# EAGLE schematic FPGA_DENDY (EAGLE 9.4.2)
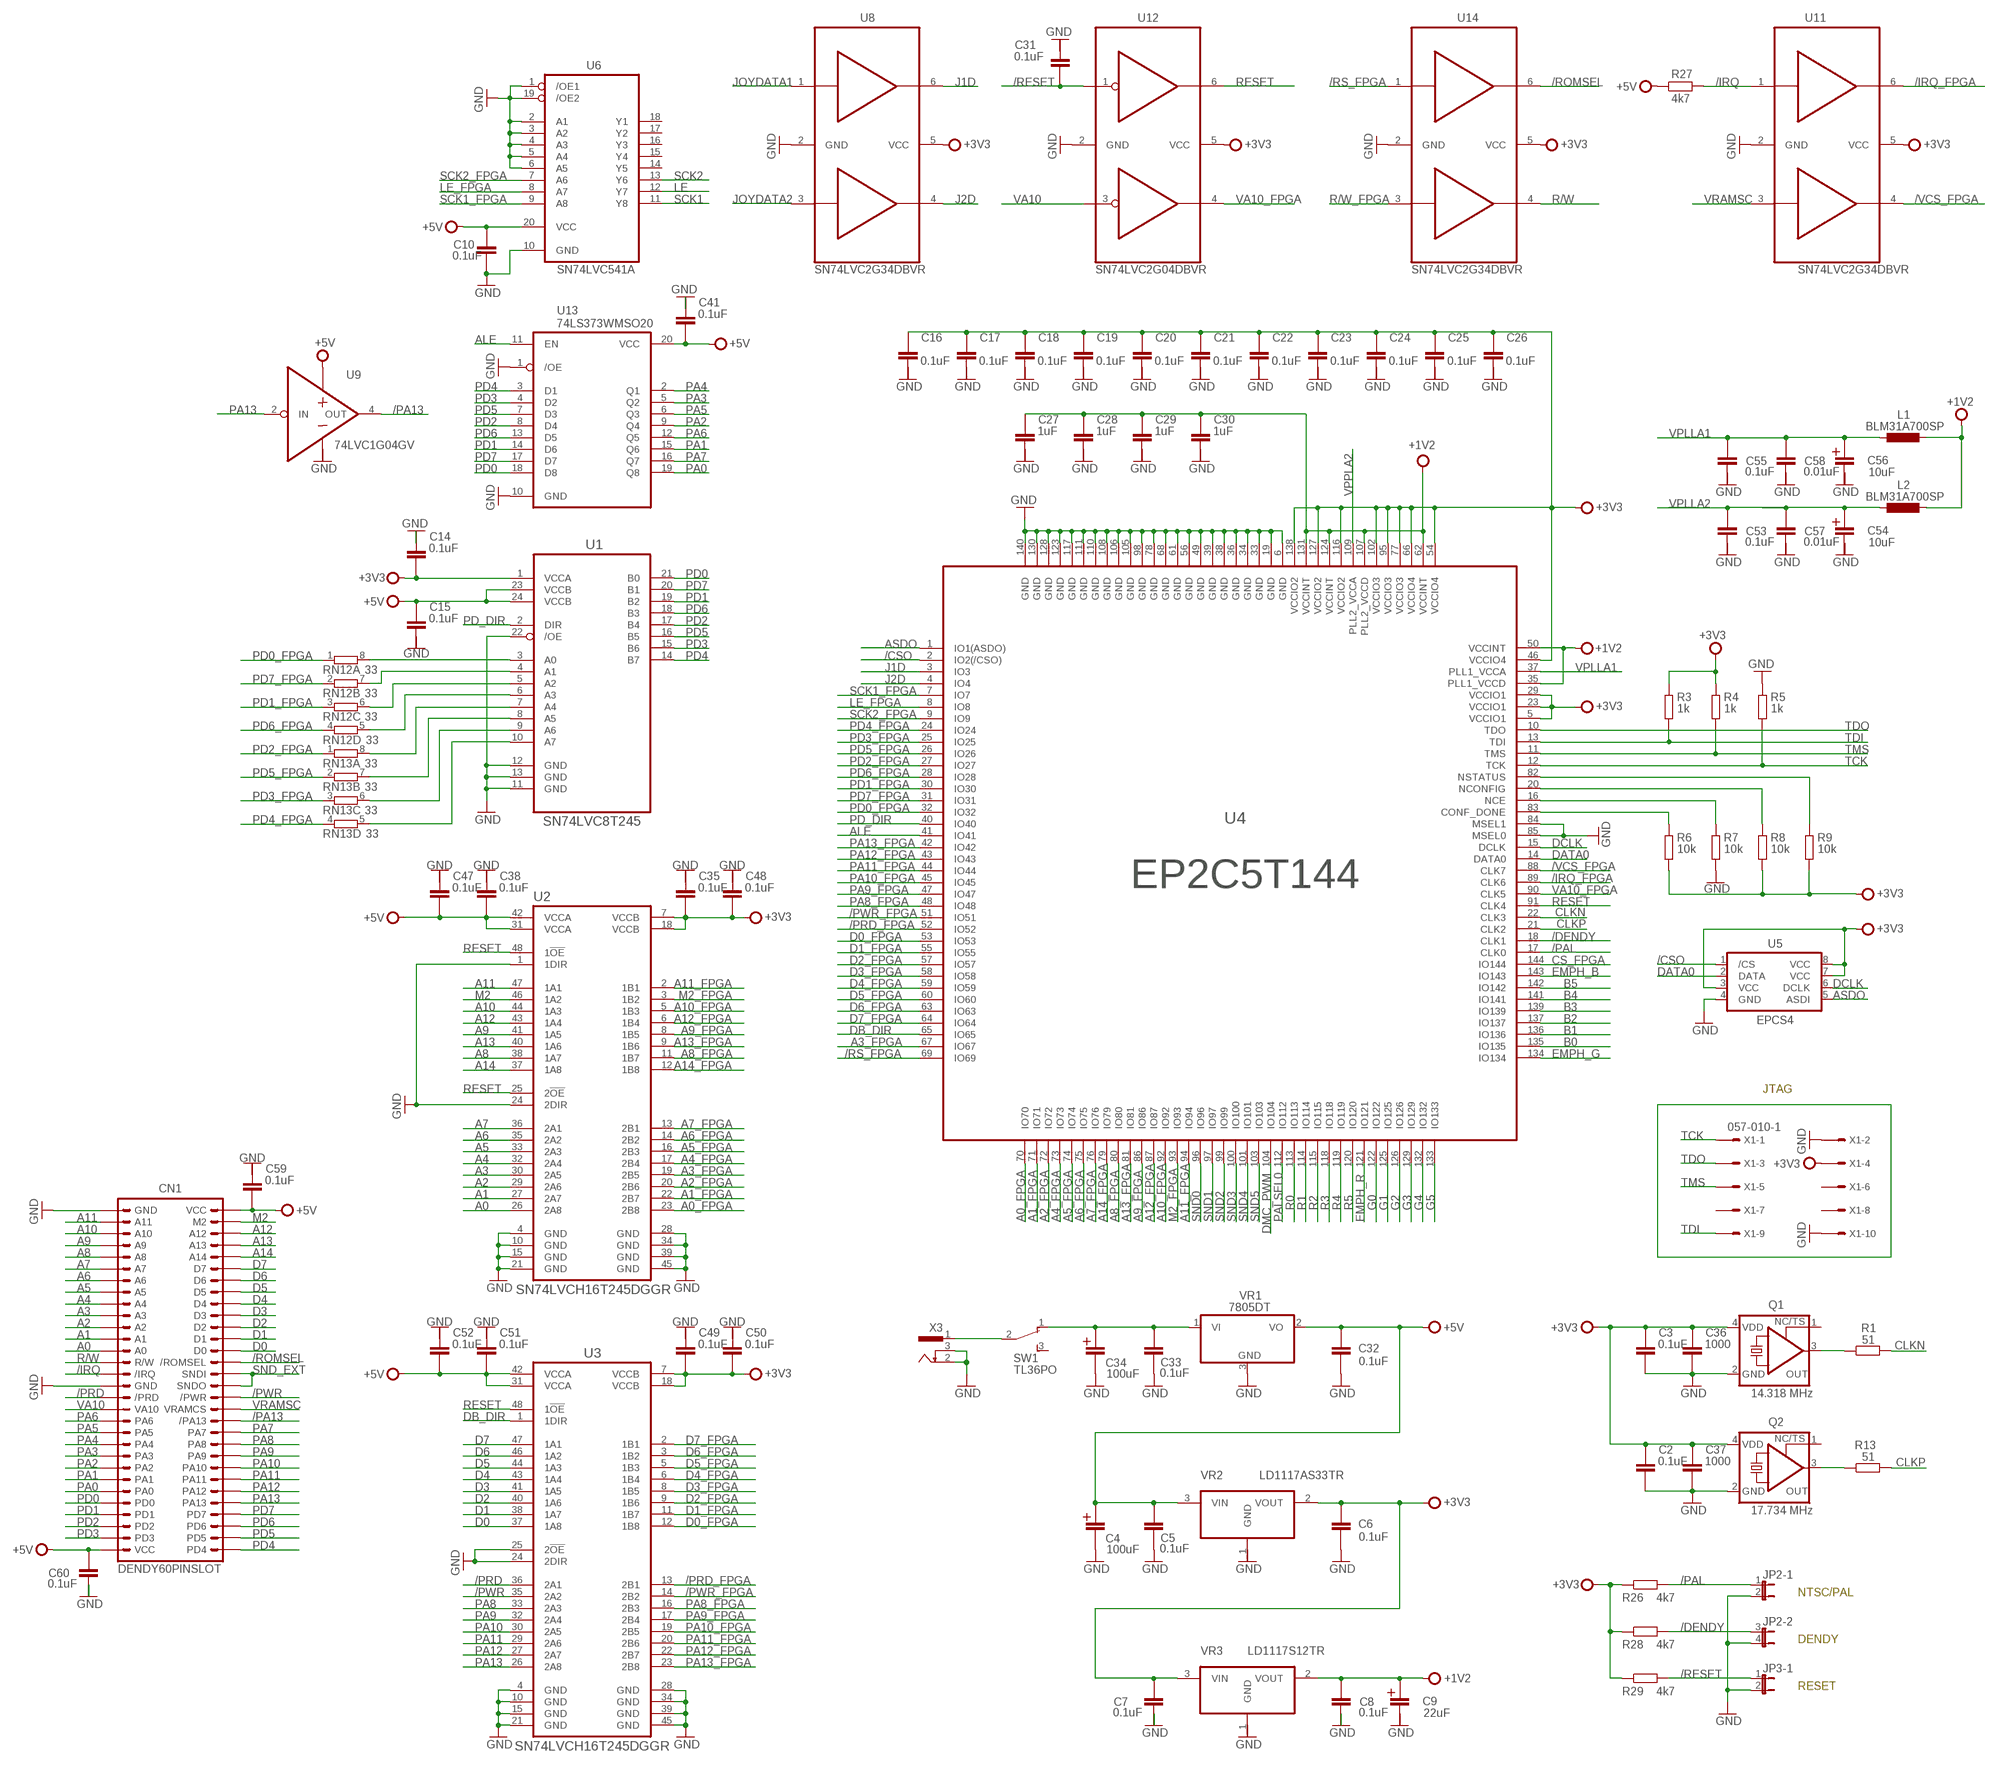
[diagram p0: schematic, sheet 1, part 1 of 2]
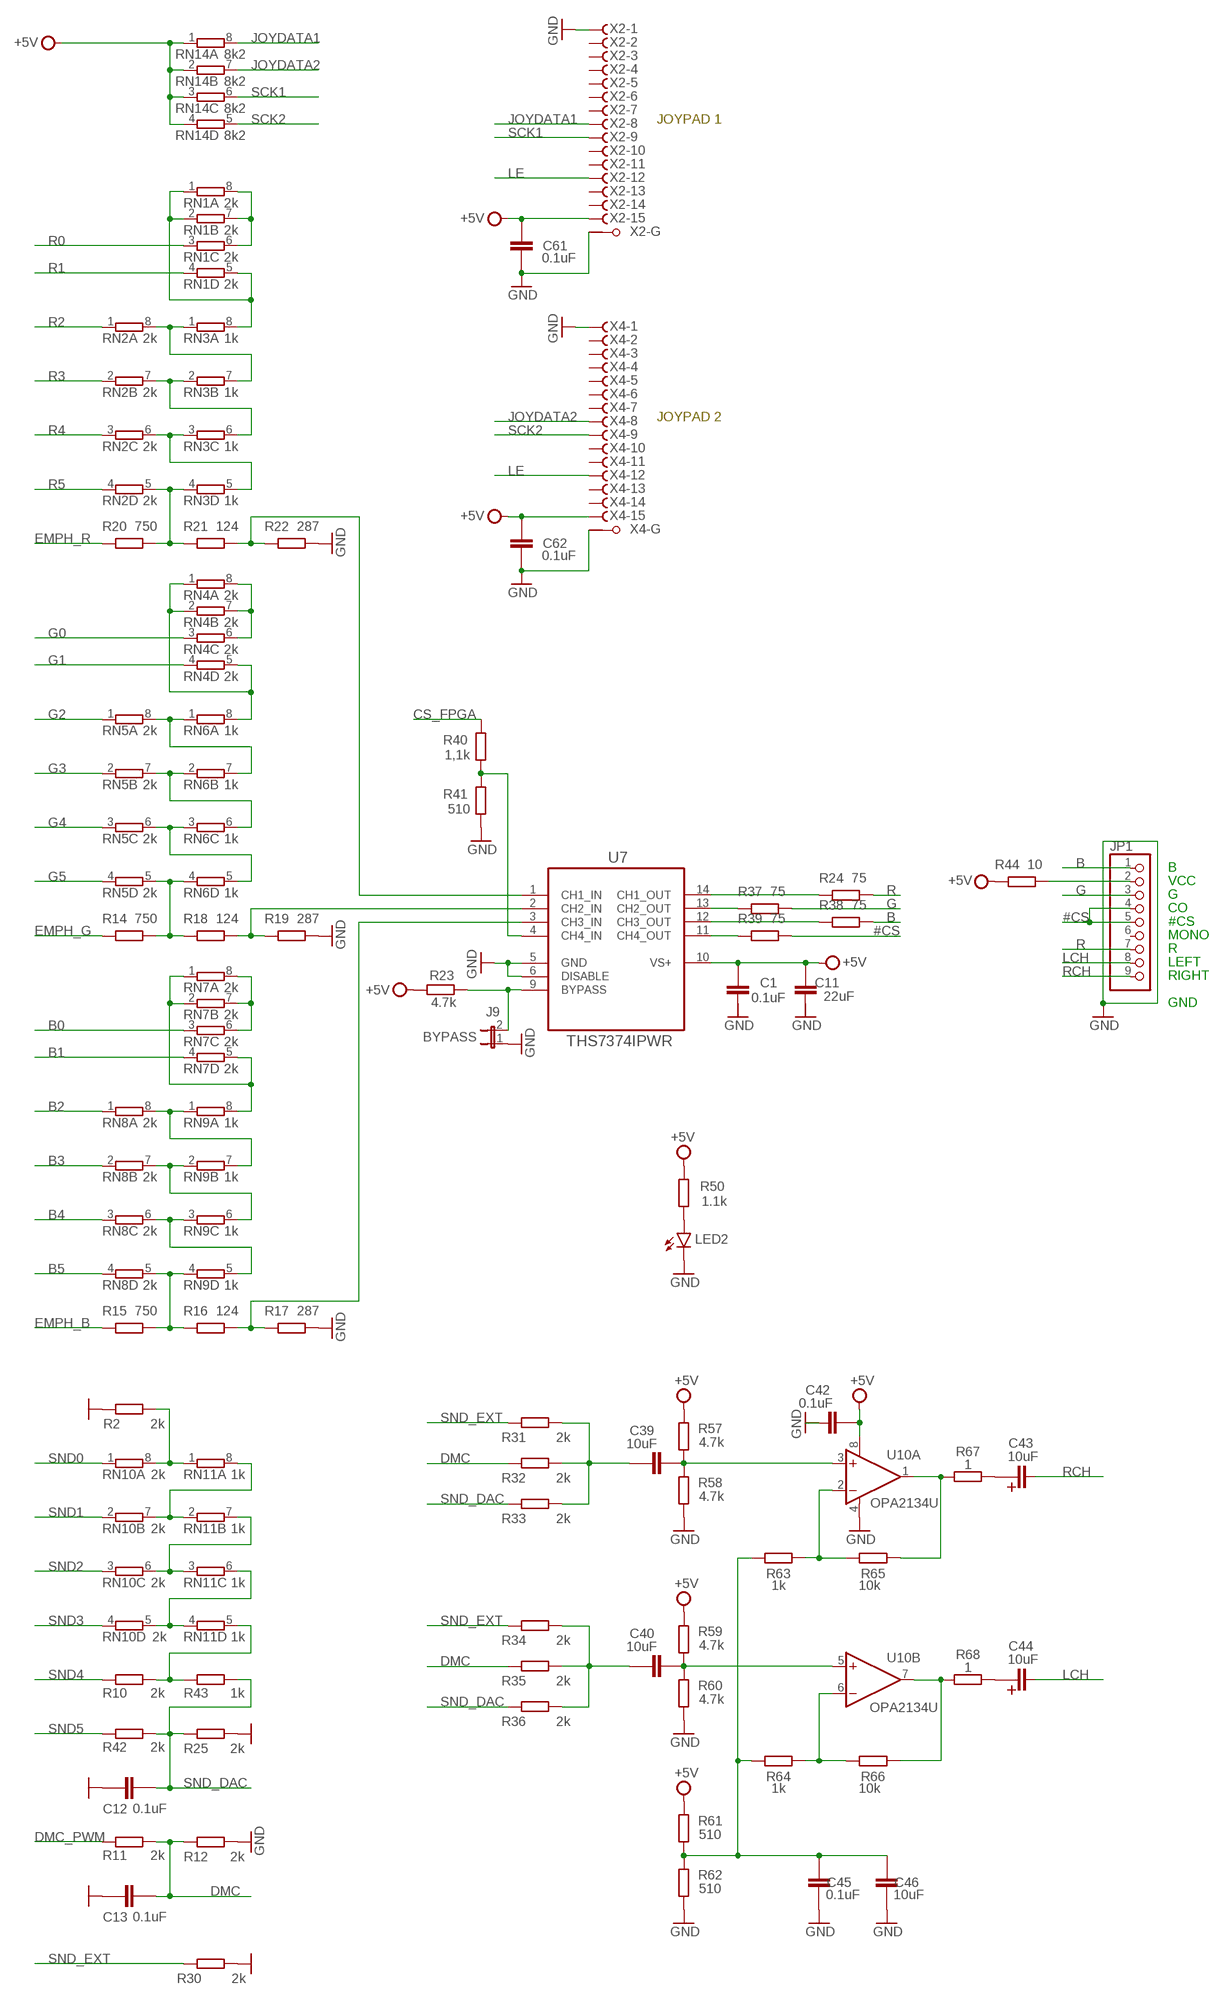
[diagram p1: schematic, sheet 1, part 2 of 2]

## Parts
C1  0.1uF  C-EUC0603  [C0603]
C2  0.1uF  C-EUC0805  [C0805]
C3  0.1uF  C-EUC0805  [C0805]
C4  100uF  CPOL-EU153CLV-0505  [153CLV-0505]
C5  0.1uF  C-EUC0805  [C0805]
C6  0.1uF  C-EUC0805  [C0805]
C7  0.1uF  C-EUC0805  [C0805]
C8  0.1uF  C-EUC0805  [C0805]
C9  22uF  CPOL-EU153CLV-0505  [153CLV-0505]
C10  0.1uF  C-EUC0805  [C0805]
C11  22uF  C-EUC0603  [C0603]
C12  0.1uF  C-EUC0805  [C0805]
C13  0.1uF  C-EUC0805  [C0805]
C14  0.1uF  C-EUC0805  [C0805]
C15  0.1uF  C-EUC0805  [C0805]
C16  0.1uF  C-EUC0805  [C0805]
C17  0.1uF  C-EUC0805  [C0805]
C18  0.1uF  C-EUC0805  [C0805]
C19  0.1uF  C-EUC0805  [C0805]
C20  0.1uF  C-EUC0805  [C0805]
C21  0.1uF  C-EUC0805  [C0805]
C22  0.1uF  C-EUC0805  [C0805]
C23  0.1uF  C-EUC0805  [C0805]
C24  0.1uF  C-EUC0805  [C0805]
C25  0.1uF  C-EUC0805  [C0805]
C26  0.1uF  C-EUC0805  [C0805]
C27  1uF  C-EUC0805  [C0805]
C28  1uF  C-EUC0805  [C0805]
C29  1uF  C-EUC0805  [C0805]
C30  1uF  C-EUC0805  [C0805]
C31  0.1uF  C-EUC0805  [C0805]
C32  0.1uF  C-EUC0805  [C0805]
C33  0.1uF  C-EUC0805  [C0805]
C34  100uF  CPOL-EU153CLV-0505  [153CLV-0505]
C35  0.1uF  C-EUC0805  [C0805]
C36  1000  C-EUC0805  [C0805]
C37  1000  C-EUC0805  [C0805]
C38  0.1uF  C-EUC0805  [C0805]
C39  10uF  C-EUC0805  [C0805]
C40  10uF  C-EUC0805  [C0805]
C41  0.1uF  C-EUC0805  [C0805]
C42  0.1uF  C-EUC0805  [C0805]
C43  10uF  CPOL-EU153CLV-0505  [153CLV-0505]
C44  10uF  CPOL-EU153CLV-0505  [153CLV-0505]
C45  0.1uF  C-EUC0805  [C0805]
C46  10uF  C-EUC0805  [C0805]
C47  0.1uF  C-EUC0805  [C0805]
C48  0.1uF  C-EUC0805  [C0805]
C49  0.1uF  C-EUC0805  [C0805]
C50  0.1uF  C-EUC0805  [C0805]
C51  0.1uF  C-EUC0805  [C0805]
C52  0.1uF  C-EUC0805  [C0805]
C53  0.1uF  C-EUC0805  [C0805]
C54  10uF  CPOL-EU153CLV-0505  [153CLV-0505]
C55  0.1uF  C-EUC0805  [C0805]
C56  10uF  CPOL-EU153CLV-0505  [153CLV-0505]
C57  0.01uF  C-EUC0805  [C0805]
C58  0.01uF  C-EUC0805  [C0805]
C59  0.1uF  C-EUC0805  [C0805]
C60  0.1uF  C-EUC0805  [C0805]
C61  0.1uF  C-EUC0805  [C0805]
C62  0.1uF  C-EUC0805  [C0805]
CN1  DENDY60PINSLOT  [60PINDENDY]
J9  BYPASS  JP1E  [JP1]
JP1  PINHD-1X9  [1X09]
JP2  JP4QE  [JP4Q]
JP3  JP4QE  [JP4Q]
L1  BLM31A700SP  L-EUL2012C  [L2012C]
L2  BLM31A700SP  L-EUL2012C  [L2012C]
LED2  LEDSML1206  [SML1206]
Q1  14.318 MHz  KXO-PXO/XO-V97  [7.0X5.08_KXO-(V)97]
Q2  17.734 MHz  KXO-PXO/XO-V95  [2.5X2.0_KXO-V95]
R1  51  R-EU_R0805  [R0805]
R2  2k  R-EU_R0805  [R0805]
R3  1k  R-EU_R0805  [R0805]
R4  1k  R-EU_R0805  [R0805]
R5  1k  R-EU_R0805  [R0805]
R6  10k  R-EU_R0805  [R0805]
R7  10k  R-EU_R0805  [R0805]
R8  10k  R-EU_R0805  [R0805]
R9  10k  R-EU_R0805  [R0805]
R10  2k  R-EU_R0805  [R0805]
R11  2k  R-EU_R0805  [R0805]
R12  2k  R-EU_R0805  [R0805]
R13  51  R-EU_R0805  [R0805]
R14  750  R-EU_R0805  [R0805]
R15  750  R-EU_R0805  [R0805]
R16  124  R-EU_R0805  [R0805]
R17  287  R-EU_R0805  [R0805]
R18  124  R-EU_R0805  [R0805]
R19  287  R-EU_R0805  [R0805]
R20  750  R-EU_R0805  [R0805]
R21  124  R-EU_R0805  [R0805]
R22  287  R-EU_R0805  [R0805]
R23  4.7k  R-EU_R0805  [R0805]
R24  75  R-EU_R0805  [R0805]
R25  2k  R-EU_R0805  [R0805]
R26  4k7  R-EU_R0805  [R0805]
R27  4k7  R-EU_R0805  [R0805]
R28  4k7  R-EU_R0805  [R0805]
R29  4k7  R-EU_R0805  [R0805]
R30  2k  R-EU_R0805  [R0805]
R31  2k  R-EU_R0805  [R0805]
R32  2k  R-EU_R0805  [R0805]
R33  2k  R-EU_R0805  [R0805]
R34  2k  R-EU_R0805  [R0805]
R35  2k  R-EU_R0805  [R0805]
R36  2k  R-EU_R0805  [R0805]
R37  75  R-EU_R0805  [R0805]
R38  75  R-EU_R0805  [R0805]
R39  75  R-EU_R0805  [R0805]
R40  1,1k  R-EU_R0805  [R0805]
R41  510  R-EU_R0805  [R0805]
R42  2k  R-EU_R0805  [R0805]
R43  1k  R-EU_R0805  [R0805]
R44  10  R-EU_R0805  [R0805]
R50  1.1k  R-EU_R0805  [R0805]
R57  4.7k  R-EU_R0805  [R0805]
R58  4.7k  R-EU_R0805  [R0805]
R59  4.7k  R-EU_R0805  [R0805]
R60  4.7k  R-EU_R0805  [R0805]
R61  510  R-EU_R0805  [R0805]
R62  510  R-EU_R0805  [R0805]
R63  1k  R-EU_R0805  [R0805]
R64  1k  R-EU_R0805  [R0805]
R65  10k  R-EU_R0805  [R0805]
R66  10k  R-EU_R0805  [R0805]
R67  1  R-EU_R0805  [R0805]
R68  1  R-EU_R0805  [R0805]
RN1  2k  4R-N0603-ARC  [0603-ARC]
RN2  2k  4R-N0603-ARC  [0603-ARC]
RN3  1k  4R-N0603-ARC  [0603-ARC]
RN4  2k  4R-N0603-ARC  [0603-ARC]
RN5  2k  4R-N0603-ARC  [0603-ARC]
RN6  1k  4R-N0603-ARC  [0603-ARC]
RN7  2k  4R-N0603-ARC  [0603-ARC]
RN8  2k  4R-N0603-ARC  [0603-ARC]
RN9  1k  4R-N0603-ARC  [0603-ARC]
RN10  2k  4R-N0603-ARC  [0603-ARC]
RN11  1k  4R-N0603-ARC  [0603-ARC]
RN12  33  4R-N0603-ARC  [0603-ARC]
RN13  33  4R-N0603-ARC  [0603-ARC]
RN14  8k2  4R-N0603-ARC  [0603-ARC]
SW1  TL36PO  [TL3XPO]
U1  SN74LVC8T245  [SOP65P640X110-24N]
U2  SN74LVCH16T245DGGR  [SOP50P810X120-48N]
U3  SN74LVCH16T245DGGR  [SOP50P810X120-48N]
U4  EP2C5T144  [TQFP144]
U5  EPCS4  [SO08]
U6  SN74LVC541A  [TSOP20]
U7  THS7374IPWR  [SOP65P640X120-14N]
U8  SN74LVC2G34DBVR  [SOT-23-6]
U9  74LVC1G04GV  [SOT95P275X110-5N]
U10  OPA2134U  [SO08]
U11  SN74LVC2G34DBVR  [SOT-23-6]
U12  SN74LVC2G04DBVR  [SOT-23-6]
U13  74LS373WMSO20  [SO20W]
U14  SN74LVC2G34DBVR  [SOT-23-6]
VR1  7805DT  [TO252]
VR2  LD1117AS33TR  [SOT230P700X180-4N]
VR3  LD1117S12TR  [SOT-223-3]
X1  057-010-1  [057-010-1]
X2  F15HPS  [F15HP]
X3  733980-62  [733980-62]
X4  F15HPS  [F15HP]

## Nets
#CS: JP1.4 JP1.5 R39.2
+1V2: C8.1 C9.+ C27.1 C28.1 C29.1 C30.1 L1.1 L2.1 U4.35(PLL1_VCCD) U4.50(VCCINT) U4.62(VCCINT) U4.107(PLL2_VCCD) U4.124(VCCINT) U4.131(VCCINT) VR3.2(VOUT)
+3V3: C2.1 C3.1 C6.1 C7.1 C14.2 C35.2 C36.1 C37.1 C48.2 C49.2 C50.2 Q1.4(VDD) Q2.4(VDD) R3.1 R4.1 R6.2 R8.2 R9.2 R26.1 R28.1 R29.1 U1.1(VCCA) U2.7(VCCB) U2.18(VCCB) U3.7(VCCB) U3.18(VCCB) U4.5(VCCIO1) U4.23(VCCIO1) U4.29(VCCIO1) U5.3(VCC) U5.7(VCC) U5.8(VCC) U8.5(VCC) U11.5(VCC) U12.5(VCC) U14.5(VCC) VR2.2(VOUT) VR3.3(VIN) X1.4
+5V: C1.2 C4.+ C5.1 C10.1 C11.2 C15.1 C32.1 C38.2 C41.2 C42.2 C47.2 C51.2 C52.2 C59.2 C60.1 C61.1 C62.1 CN1.A30(VCC) CN1.B1(VCC) R23.1 R27.1 R44.1 R50.2 R57.1 R59.1 R61.1 RN14.1 RN14.2 RN14.3 RN14.4 U1.23(VCCB) U1.24(VCCB) U2.31(VCCA) U2.42(VCCA) U3.31(VCCA) U3.42(VCCA) U6.20(VCC) U7.10(VS+) U9.5(VCC) U10.8(A:V+) U13.20(VCC) VR1.2(VO) VR2.3(VIN) X2.15(-15:F) X4.15(-15:F)
/CSO: U4.2(IO2(/CSO)) U5.1(/CS)
/DENDY: JP2.3 R28.2 U4.18(CLK1)
/IRQ: CN1.A15(/IRQ) R27.2 U11.1(IN1)
/IRQ_FPGA: U4.89(CLK6) U11.6(OUT1)
/PA13: CN1.B19(/PA13) U9.4(OUT)
/PAL: JP2.1 R26.2 U4.17(CLK0)
/PRD: CN1.A17(/PRD) U3.36(2A1)
/PRD_FPGA: U3.13(2B1) U4.52(IO52)
/PWR: CN1.B17(/PWR) U3.35(2A2)
/PWR_FPGA: U3.14(2B2) U4.51(IO51)
/RESET: C31.2 JP3.1 R29.2 U12.1(IN1)
/ROMSEL: CN1.B14(/ROMSEL) U14.6(OUT1)
/RS_FPGA: U4.69(IO69) U14.1(IN1)
/VCS_FPGA: U4.88(CLK7) U11.4(OUT2)
A0: CN1.A13(A0) U2.26(2A8)
A0_FPGA: U2.23(2B8) U4.70(IO70)
A1: CN1.A12(A1) U2.27(2A7)
A1_FPGA: U2.22(2B7) U4.71(IO71)
A2: CN1.A11(A2) U2.29(2A6)
A2_FPGA: U2.20(2B6) U4.72(IO72)
A3: CN1.A10(A3) U2.30(2A5)
A3_FPGA: U2.19(2B5) U4.67(IO67)
A4: CN1.A9(A4) U2.32(2A4)
A4_FPGA: U2.17(2B4) U4.73(IO73)
A5: CN1.A8(A5) U2.33(2A3)
A5_FPGA: U2.16(2B3) U4.74(IO74)
A6: CN1.A7(A6) U2.35(2A2)
A6_FPGA: U2.14(2B2) U4.75(IO75)
A7: CN1.A6(A7) U2.36(2A1)
A7_FPGA: U2.13(2B1) U4.76(IO76)
A8: CN1.A5(A8) U2.38(1A7)
A8_FPGA: U2.11(1B7) U4.80(IO80)
A9: CN1.A4(A9) U2.41(1A5)
A9_FPGA: U2.8(1B5) U4.86(IO86)
A10: CN1.A3(A10) U2.44(1A3)
A10_FPGA: U2.5(1B3) U4.92(IO92)
A11: CN1.A2(A11) U2.47(1A1)
A11_FPGA: U2.2(1B1) U4.94(IO94)
A12: CN1.B3(A12) U2.43(1A4)
A12_FPGA: U2.6(1B4) U4.87(IO87)
A13: CN1.B4(A13) U2.40(1A6)
A13_FPGA: U2.9(1B6) U4.81(IO81)
A14: CN1.B5(A14) U2.37(1A8)
A14_FPGA: U2.12(1B8) U4.79(IO79)
ALE: U4.41(IO41) U13.11(EN)
ASDO: U4.1(IO1(ASDO)) U5.5(ASDI)
B: JP1.1 R38.2
B0: RN7.3 U4.135(IO135)
B1: RN7.4 U4.136(IO136)
B2: RN8.1 U4.137(IO137)
B3: RN8.2 U4.139(IO139)
B4: RN8.3 U4.141(IO141)
B5: RN8.4 U4.142(IO142)
CLKN: R1.2 U4.22(CLK3)
CLKP: R13.2 U4.21(CLK2)
CS_FPGA: R40.2 U4.144(IO144)
D0: CN1.B13(D0) U3.37(1A8)
D0_FPGA: U3.12(1B8) U4.53(IO53)
D1: CN1.B12(D1) U3.38(1A7)
D1_FPGA: U3.11(1B7) U4.55(IO55)
D2: CN1.B11(D2) U3.40(1A6)
D2_FPGA: U3.9(1B6) U4.57(IO57)
D3: CN1.B10(D3) U3.41(1A5)
D3_FPGA: U3.8(1B5) U4.58(IO58)
D4: CN1.B9(D4) U3.43(1A4)
D4_FPGA: U3.6(1B4) U4.59(IO59)
D5: CN1.B8(D5) U3.44(1A3)
D5_FPGA: U3.5(1B3) U4.60(IO60)
D6: CN1.B7(D6) U3.46(1A2)
D6_FPGA: U3.3(1B2) U4.63(IO63)
D7: CN1.B6(D7) U3.47(1A1)
D7_FPGA: U3.2(1B1) U4.64(IO64)
DATA0: U4.14(DATA0) U5.2(DATA)
DB_DIR: U3.1(1DIR) U4.65(IO65)
DCLK: U4.15(DCLK) U5.6(DCLK)
DMC: C13.2 R11.2 R12.1 R32.1 R35.1
DMC_PWM: R11.1 U4.104(IO104)
EMPH_B: R15.1 U4.143(IO143)
EMPH_G: R14.1 U4.134(IO134)
EMPH_R: R20.1 U4.121(IO121)
G: JP1.3 R37.2
G0: RN4.3 U4.122(IO122)
G1: RN4.4 U4.125(IO125)
G2: RN5.1 U4.126(IO126)
G3: RN5.2 U4.129(IO129)
G4: RN5.3 U4.132(IO132)
G5: RN5.4 U4.133(IO133)
GND: C2.2 C3.2 C4.- C5.2 C6.2 C7.2 C8.2 C10.2 C12.1 C13.1 C14.1 C32.2 C33.2 C34.- C36.2 C37.2 C41.1 C42.1 C45.2 C46.2 C60.2 C61.2 C62.2 CN1.A1(GND) CN1.A16(GND) J9.1 JP2.2 JP2.4 JP3.2 LED2.C Q1.2(GND) Q2.2(GND) R2.1 R5.1 R7.2 R12.2 R17.2 R19.2 R22.2 R25.2 R30.2 R41.1 R58.2 R60.2 R62.2 U1.11(GND) U1.12(GND) U1.13(GND) U1.22(/OE) U2.1(1DIR) U2.4(GND) U2.10(GND) U2.15(GND) U2.21(GND) U2.24(2DIR) U2.28(GND) U2.34(GND) U2.39(GND) U2.45(GND) U3.4(GND) U3.10(GND) U3.15(GND) U3.21(GND) U3.24(2DIR) U3.25(2!OE) U3.28(GND) U3.34(GND) U3.39(GND) U3.45(GND) U4.6(GND) U4.19(GND) U4.33(GND) U4.34(GND) U4.36(GND) U4.38(GND) U4.39(GND) U4.49(GND) U4.56(GND) U4.61(GND) U4.68(GND) U4.78(GND) U4.84(MSEL1) U4.85(MSEL0) U4.98(GND) U4.105(GND) U4.106(GND) U4.108(GND) U4.110(GND) U4.111(GND) U4.117(GND) U4.123(GND) U4.128(GND) U4.130(GND) U4.140(GND) U5.4(GND) U6.1(/OE1) U6.2(A1) U6.3(A2) U6.4(A3) U6.5(A4) U6.6(A5) U6.10(GND) U6.19(/OE2) U7.5(GND) U7.6(DISABLE) U8.2(GND) U10.4(A:V-) U11.2(GND) U12.2(GND) U13.1(/OE) U13.10(GND) U14.2(GND) VR1.3(GND) X1.2 X1.10 X2.1(-1:F) X2.G1(-G:G1) X3.2 X3.3 X4.1(-1:F) X4.G1(-G:G1)
J1D: U4.3(IO3) U8.6(OUT1)
J2D: U4.4(IO4) U8.4(OUT2)
JOYDATA1: RN14.8 U8.1(IN1) X2.8(-8:F)
JOYDATA2: RN14.7 U8.3(IN2) X4.8(-8:F)
LCH: JP1.8
LE: U6.12(Y7) X2.12(-12:F) X4.12(-12:F)
LE_FPGA: U4.8(IO8) U6.8(A7)
M2: CN1.B2(M2) U2.46(1A2)
M2_FPGA: U2.3(1B2) U4.93(IO93)
N$1: C39.1 R31.2 R32.2 R33.2
N$2: Q2.3(OUT) R13.1
N$4: C43.-
N$5: RN10.7 RN11.2 RN11.8
N$6: Q1.3(OUT) R1.1
N$7: R7.1 U4.16(NCE)
N$8: R2.2 RN10.8 RN11.1
N$9: RN12.8 U1.3(A0)
N$10: RN12.7 U1.4(A1)
N$11: C44.-
N$12: RN12.6 U1.5(A2)
N$13: RN12.5 U1.6(A3)
N$14: RN8.8 RN9.1 RN9.7
N$15: C33.1 C34.+ SW1.1(O) VR1.1(VI)
N$16: RN7.6 RN7.7 RN7.8
N$17: RN13.8 U1.7(A4)
N$18: RN7.1 RN7.2 RN7.5 RN9.8
N$19: R16.2 R17.1 U7.3(CH3_IN)
N$20: R9.1 U4.82(NSTATUS)
N$21: R8.1 U4.20(NCONFIG)
N$22: R6.1 U4.83(CONF_DONE)
N$23: RN8.7 RN9.2 RN9.6
N$24: RN5.8 RN6.1 RN6.7
N$25: RN4.6 RN4.7 RN4.8
N$26: RN5.6 RN6.3 RN6.5
N$27: RN8.6 RN9.3 RN9.5
N$28: R18.2 R19.1 U7.2(CH2_IN)
N$29: R15.2 R16.1 RN8.5 RN9.4
N$30: C40.1 R34.2 R35.2 R36.2
N$31: RN13.7 U1.8(A5)
N$32: RN13.6 U1.9(A6)
N$33: RN4.1 RN4.2 RN4.5 RN6.8
N$34: RN2.8 RN3.1 RN3.7
N$35: RN1.6 RN1.7 RN1.8
N$36: RN5.7 RN6.2 RN6.6
N$37: C43.+ R67.2
N$38: R14.2 R18.1 RN5.5 RN6.4
N$39: RN1.1 RN1.2 RN1.5 RN3.8
N$40: RN2.7 RN3.2 RN3.6
N$41: RN2.6 RN3.3 RN3.5
N$42: R63.2 R65.1 U10.2(A:-IN)
N$43: R65.2 R67.1 U10.1(A:OUT)
N$44: R66.2 R68.1 U10.7(B:OUT)
N$45: R64.2 R66.1 U10.6(B:-IN)
N$46: C39.2 R57.2 R58.1 U10.3(A:+IN)
N$47: C40.2 R59.2 R60.1 U10.5(B:+IN)
N$48: C44.+ R68.2
N$50: JP1.2 R44.2
N$53: R20.2 R21.1 RN2.5 RN3.4
N$55: R10.2 R43.1 RN11.5
N$56: J9.2 R23.2 U7.9(BYPASS)
N$57: RN10.6 RN11.3 RN11.7
N$58: R21.2 R22.1 U7.1(CH1_IN)
N$59: RN10.5 RN11.4 RN11.6
N$61: RN13.5 U1.10(A7)
N$62: R40.1 R41.2 U7.4(CH4_IN)
N$63: LED2.A R50.1
N$64: R24.1 U7.14(CH1_OUT)
N$65: R37.1 U7.13(CH2_OUT)
N$66: R38.1 U7.12(CH3_OUT)
N$67: R39.1 U7.11(CH4_OUT)
N$77: SW1.2(P) X3.1
PA0: CN1.A25(PA0) U13.19(Q8)
PA1: CN1.A24(PA1) U13.15(Q6)
PA2: CN1.A23(PA2) U13.9(Q4)
PA3: CN1.A22(PA3) U13.5(Q2)
PA4: CN1.A21(PA4) U13.2(Q1)
PA5: CN1.A20(PA5) U13.6(Q3)
PA6: CN1.A19(PA6) U13.12(Q5)
PA7: CN1.B20(PA7) U13.16(Q7)
PA8: CN1.B21(PA8) U3.33(2A3)
PA8_FPGA: U3.16(2B3) U4.48(IO48)
PA9: CN1.B22(PA9) U3.32(2A4)
PA9_FPGA: U3.17(2B4) U4.47(IO47)
PA10: CN1.B23(PA10) U3.30(2A5)
PA10_FPGA: U3.19(2B5) U4.45(IO45)
PA11: CN1.B24(PA11) U3.29(2A6)
PA11_FPGA: U3.20(2B6) U4.44(IO44)
PA12: CN1.B25(PA12) U3.27(2A7)
PA12_FPGA: U3.22(2B7) U4.43(IO43)
PA13: CN1.B26(PA13) U3.26(2A8) U9.2(IN)
PA13_FPGA: U3.23(2B8) U4.42(IO42)
PALSEL0: U4.112(IO112)
PD0: CN1.A26(PD0) U1.21(B0) U13.18(D8)
PD0_FPGA: RN12.1 U4.32(IO32)
PD1: CN1.A27(PD1) U1.19(B2) U13.14(D6)
PD1_FPGA: RN12.3 U4.30(IO30)
PD2: CN1.A28(PD2) U1.17(B4) U13.8(D4)
PD2_FPGA: RN13.1 U4.27(IO27)
PD3: CN1.A29(PD3) U1.15(B6) U13.4(D2)
PD3_FPGA: RN13.3 U4.25(IO25)
PD4: CN1.B30(PD4) U1.14(B7) U13.3(D1)
PD4_FPGA: RN13.4 U4.24(IO24)
PD5: CN1.B29(PD5) U1.16(B5) U13.7(D3)
PD5_FPGA: RN13.2 U4.26(IO26)
PD6: CN1.B28(PD6) U1.18(B3) U13.13(D5)
PD6_FPGA: RN12.4 U4.28(IO28)
PD7: CN1.B27(PD7) U1.20(B1) U13.17(D7)
PD7_FPGA: RN12.2 U4.31(IO31)
PD_DIR: U1.2(DIR) U4.40(IO40)
R: JP1.7 R24.2
R0: RN1.3 U4.113(IO113)
R1: RN1.4 U4.114(IO114)
R2: RN2.1 U4.115(IO115)
R3: RN2.2 U4.118(IO118)
R4: RN2.3 U4.119(IO119)
R5: RN2.4 U4.120(IO120)
R/W: CN1.A14(R/W) U14.4(OUT2)
R/W_FPGA: U14.3(IN2)
RCH: JP1.9
RESET: U2.25(2!OE) U2.48(1!OE) U3.48(1!OE) U4.91(CLK4) U12.6(OUT1)
SCK1: RN14.6 U6.11(Y8) X2.9(-9:F)
SCK1_FPGA: U4.7(IO7) U6.9(A8)
SCK2: RN14.5 U6.13(Y6) X4.9(-9:F)
SCK2_FPGA: U4.9(IO9) U6.7(A6)
SND0: RN10.1 U4.96(IO96)
SND1: RN10.2 U4.97(IO97)
SND2: RN10.3 U4.99(IO99)
SND3: RN10.4 U4.100(IO100)
SND4: R10.1 U4.101(IO101)
SND5: R42.1 U4.103(IO103)
SND_DAC: C12.2 R25.1 R33.1 R36.1 R42.2 R43.2
SND_EXT: CN1.B15(SNDI) CN1.B16(SNDO) R30.1 R31.1 R34.1
TCK: R5.2 U4.12(TCK) X1.1
TDI: R3.2 U4.13(TDI) X1.9
TDO: U4.10(TDO) X1.3
TMS: R4.2 U4.11(TMS) X1.5
VA10: CN1.A18(VA10) U12.3(IN2)
VA10_FPGA: U4.90(CLK5) U12.4(OUT2)
VCC3.1: C16.1 C17.1 C18.1 C19.1 C20.1 C21.1 C22.1 C23.1 C24.1 C25.1 C26.1 U4.46(VCCIO4) U4.54(VCCIO4) U4.66(VCCIO4) U4.77(VCCIO3) U4.95(VCCIO3) U4.102(VCCIO3) U4.116(VCCIO2) U4.127(VCCIO2) U4.138(VCCIO2) ; supply symbol labelled +3V3
VPLLA1: C55.1 C56.+ C58.1 L1.2 U4.37(PLL1_VCCA)
VPLLA2: C53.1 C54.+ C57.1 L2.2
VPPL3: C45.1 C46.1 R61.2 R62.1 R63.1 R64.1
VPPLA2: U4.109(PLL2_VCCA)
VRAMSC: CN1.B18(VRAMCS) U11.3(IN2)
Unconnected: C1.1 C9.- C11.1 C15.2 C16.2 C17.2 C18.2 C19.2 C20.2 C21.2 C22.2 C23.2 C24.2 C25.2 C26.2 C27.2 C28.2 C29.2 C30.2 C31.1 C35.1 C38.1 C47.1 C48.1 C49.1 C50.1 C51.1 C52.1 C53.2 C54.- C55.2 C56.- C57.2 C58.2 C59.1 JP1.6 JP2.5 JP2.6 JP2.7 JP2.8 JP3.3 JP3.4 JP3.5 JP3.6 JP3.7 JP3.8 Q1.1(TS) Q2.1(TS) SW1.3(S) U6.14(Y5) U6.15(Y4) U6.16(Y3) U6.17(Y2) U6.18(Y1) U9.3(GND) VR2.1(GND) VR3.1(GND) X1.6 X1.7 X1.8 X2.2(-2:F) X2.3(-3:F) X2.4(-4:F) X2.5(-5:F) X2.6(-6:F) X2.7(-7:F) X2.10(-10:F) X2.11(-11:F) X2.13(-13:F) X2.14(-14:F) X2.G2(-G:G2) X4.2(-2:F) X4.3(-3:F) X4.4(-4:F) X4.5(-5:F) X4.6(-6:F) X4.7(-7:F) X4.10(-10:F) X4.11(-11:F) X4.13(-13:F) X4.14(-14:F) X4.G2(-G:G2)

## Notes on the sheet
- JOYPAD 1
- JOYPAD 2
- B
- VCC
- G
- CO
- #CS
- MONO
- R
- LEFT
- RIGHT
- GND
- JTAG
- NTSC/PAL
- DENDY
- RESET

## Library data of the parts
C1-C3 C5-C8 C10-C33 C35-C42 C45-C53 C55 C57-C62 = rcl_my:C-EU: CAPACITOR, European symbol; SPICEPREFIX: C
C4 C9 C34 C43 C44 C54 C56 = rcl_my:CPOL-EU: POLARIZED CAPACITOR, European symbol; SPICEPREFIX: C
CN1 = DENDY60pin:DENDY60PINSLOT
J9 = jumper:JP1E: JUMPER
JP1 = pinhead:PINHD-1X9: PIN HEADER
JP2 JP3 = jumper:JP4QE: JUMPER
L1 L2 = rcl:L-EU: INDUCTOR, European symbol; SPICEPREFIX: L
LED2 = led:LED: LED OSRAM: - CHIPLED LG R971, LG N971, LY N971, LG Q971, LY Q971, LO R971, LY R971 LH N974, LH R974 LS Q976, LO Q976, LY Q976 LO Q996 - Hyper CHIPLED LW Q18S LB Q993, LB Q99A, LB R99A - SideLED LS A670, LO A670, LY A670, LG A670, LP A670 LB A673, LV A673, LT A673, LW A673 LH A674 LY A675 LS A676, LA A676, LO A676, LY A676, LW A676 LS A679, LY A679, LG A679 - Hyper Micro SIDELED® LS Y876, LA Y876, LO Y876, LY Y876 LT Y87S - SmartLED LW L88C, LW L88S LB L89C, LB L89S, LG L890 LS L89K, LO L89K, LY L89K LS L896, LA L896, LO L896, LY L896 - TOPLED LS T670, LO T670, LY T670, LG T670, LP T670 LSG T670, LSP T670, LSY T670, LOP T670, LYG T670 LG T671, LOG T671, LSG T671 LB T673, LV T673, LT T673, LW T673 LH T674 LS T676, LA T676, LO T676, LY T676, LB T676, LH T676, LSB T676, LW T676 LB T67C, LV T67C, LT T67C, LS T67K, LO T67K, LY T67K, LW E67C LS E67B, LA E67B, LO E67B, LY E67B, LB E67C, LV E67C, LT E67C LW T67C LS T679, LY T679, LG T679 LS T770, LO T770, LY T770, LG T770, LP T770 LB T773, LV T773, LT T773, LW T773 LH T774 LS E675, LA E675, LY E675, LS T675 LS T776, LA T776, LO T776, LY T776, LB T776 LHGB T686 LT T68C, LB T68C - Hyper Mini TOPLED® LB M676 - Mini TOPLED Santana® LG M470 LS M47K, LO M47K, LY M47K Source: http://www.osram.convergy.de LUXEON: - LUMILED® LXK2-PW12-R00, LXK2-PW12-S00, LXK2-PW14-U00, LXK2-PW14-V00 LXK2-PM12-R00, LXK2-PM12-S00, LXK2-PM14-U00 LXK2-PE12-Q00, LXK2-PE12-R00, LXK2-PE12-S00, LXK2-PE14-T00, LXK2-PE14-U00 LXK2-PB12-K00, LXK2-PB12-L00, LXK2-PB12-M00, LXK2-PB14-N00, LXK2-PB14-P00, LXK2-PB14-Q00 LXK2-PR12-L00, LXK2-PR12-M00, LXK2-PR14-Q00, LXK2-PR14-R00 LXK2-PD12-Q00, LXK2-PD12-R00, LXK2-PD12-S00 LXK2-PH12-R00, LXK2-PH12-S00 LXK2-PL12-P00, LXK2-PL12-Q00, LXK2-PL12-R00 Source: www.luxeon.com KINGBRIGHT: KA-3528ASYC Source: www.kingbright.com
Q1 Q2 = crystal-geyer_V1_0:KXO-PXO/XO-V: Clock Oscillator (PXO/XO) MHz : KXO-V - Serie Model Size l/w/h [mm] Frequency Range Frequency Stability Temp. Range [°C] Output AECQ 200 availabel Datasheet KXO-V94 KXO-V94 KXO-V95 KXO-V95 KXO-V96 KXO-V96 KXO-V99 KXO-V99 KXO-97 KXO-V97 KXO-97 - KXO-V97 2.0/1.6/0.80 2.0/1.6/0.80 2.5/2.0/0.82 2.5/2.0/0.82 3.2/2.5/1.2 3.2/2.5/1.2 5.0/3.2/1.2 5.0/3.2/1.2 7.0/5.08/1.3 7.0/5.08/1.3 7.0/5.08/1.3 32,768 kHz 1,0 ~ 80,0 MHz 32,768 kHz 1,0 ~ 70,0 MHz 32,768 kHz 1,0 ~ 156,0 MHz 32,768 kHz 1,0 ~ 200,0 MHz 32,768 kHz 32,768 kHz 1,0 ~ 160,0 MHz ±25 … ±100ppm ±25 … ±100ppm ±25 … ±100ppm ±25 … ±100ppm ±25 … ±100ppm ±25 … ±100ppm ±25 … ±100ppm ±25 … ±100ppm ±25 … ±100ppm ±25 … ±100ppm ±25 … ±100ppm (*) -40°C …+85°C (*) -40°C …+85°C (*) -40°C …+85°C (*) -40°C …+85°C (*) -40°C …+85°C (*) -40°C …+85°C (*) -40°C …+85°C (*) -40°C …+85°C (*) -40°C …+85°C (*) -40°C …+85°C (*) -40°C …+85°C HCMOS HCMOS HCMOS HCMOS HCMOS HCMOS HCMOS HCMOS HCMOS HCMOS HCMOS - - yes yes yes yes - - - - - KXO-V94-kHz.pdf <http://www.geyer-electronic.de/uploads/tx_userartikelfrequenz/GEYER-KXO-V94-kHz.pdf> KXO-V94.pdf <http://www.geyer-electronic.de/uploads/tx_userartikelfrequenz/GEYER-KXO-V94.pdf> KXO-V95-kHz.pdf <http://www.geyer-electronic.de/uploads/tx_userartikelfrequenz/GEYER-KXO-V95-kHz.pdf> KXO-V95.pdf <http://www.geyer-electronic.de/uploads/tx_userartikelfrequenz/GEYER-KXO-V95.pdf> KXO-V96-kHz.pdf <http://www.geyer-electronic.de/uploads/tx_userartikelfrequenz/GEYER-KXO-V96-kHz.pdf> KXO-V96.pdf <http://www.geyer-electronic.de/uploads/tx_userartikelfrequenz/GEYER-KXO-V96.pdf> KXO-V99-kHz.pdf <http://www.geyer-electronic.de/uploads/tx_userartikelfrequenz/GEYER-KXO-V99-kHz.pdf> KXO-V99.pdf <http://www.geyer-electronic.de/uploads/tx_userartikelfrequenz/GEYER-KXO-V99.pdf> KXO-97-kHz.pdf <http://www.geyer-electronic.de/uploads/tx_userartikelfrequenz/GEYER-KXO-97-kHz.pdf> KXO-V97-kHz.pdf <http://www.geyer-electronic.de/uploads/tx_userartikelfrequenz/GEYER-KXO-V97-kHz.pdf> KXO-V97.pdf <http://www.geyer-electronic.de/uploads/tx_userartikelfrequenz/GEYER-KXO-V97.pdf> <http://www.geyer-electronic.de/fileadmin/template/img/logo-geyer-electronic.png> Details see: http://www.geyer-electronic.de/Frequenz-Produkte.9.0.html Created 2016-06-07, Hans Locher 2016 (C) Geyer Quartz Technology Hans Locher KXOV94,KXOV95;KXOV96;KXOV97;KXO97;2016;2520;3225;5032;70508;2,5x2,0;3,2x2,5;5,0x3,2;7,0x5,08;2.5x2.0;3.2x2.5;5.0x3.2;7.0x5.08;
R1-R44 R50 R57-R68 = rcl:R-EU_: RESISTOR, European symbol; SPICEPREFIX: R
RN1-RN14 = resistor-dil:4R-N: Array Chip Resistor Source: RS Component / Phycomp; OC_FARNELL: unknown; OC_NEWARK: unknown
SW1 = switch:TL36PO: TINY SWITCH ON - ON Source: http://www2.produktinfo.conrad.com/datenblaetter/700000-724999/705152-da-01-de-Subminiaturschalter_TL_36YO.pdf
U1 = SnapEDA-Library:SN74LVC8T245
U2 U3 = SN74LVCH16T245DGGR:SN74LVCH16T245DGGR: Check availability <https://pricing.snapeda.com/parts/SN74LVCH16T245DGGR/Texas%20Instruments/view-part?ref=eda>; AVAILABILITY: In Stock; CHECK_PRICES: https://www.snapeda.com/parts/SN74LVCH16T245DGGR/Texas+Instruments/view-part/?ref=eda; DESCRIPTION: 16-Bit Dual-Supply Bus Transceiver, Configurable Voltage Translation, 3-State Outputs; MF: Texas Instruments; MP: SN74LVCH16T245DGGR; PACKAGE: TSSOP-48 Texas Instruments; PRICE: None; SNAPEDA_LINK: https://www.snapeda.com/parts/SN74LVCH16T245DGGR/Texas+Instruments/view-part/?ref=snap
U4 = altera-cyclone-II:EP2C5T144: EP2C5T144 Auto generated by make-symbol-device-package-bsdl.ulp Rev. 19 Tip: Use split-device-symbol.ulp to generate a Device with multiple small symbols! Read HELP. Source: EP2C5T144.BSD; MPN: EP2C5T144C8N; OC_FARNELL: 1453495; OC_NEWARK: 51R0568
U5 = EPCS4:EPCS4
U6 = SnapEDA-Library:SN74LVC541A; PACKAGE: TSSOP-20; SUPPLIER: TI
U7 = THS7374IPWR:THS7374IPWR
U8 U11 U14 = SN74LVC2G34DBVR:SN74LVC2G34DBVR
U9 = 74LVC1G04GV:74LVC1G04GV
U10 = burr-brown:OPA2134: Operational Amplifier; MF: TEXAS INSTRUMENTS; MPN: OPA2134UA; OC_FARNELL: 1206935; OC_NEWARK: 35C1847
U12 = SN74LVC2G04DBVR:SN74LVC2G04DBVR
U13 = 74LS373WM:74LS373WM
VR1 = linear stab:78*: Positive VOLTAGE REGULATOR Source: http://cache.national.com/ds/LM/LM78L05.pdf http://www.fairchildsemi.com/ds/LM/LM7805.pdf
VR2 = LD1117AS33TR:LD1117AS33TR
VR3 = LD1117S12TR:LD1117S12TR
X1 = con-panduit:057-010-: CONNECTOR 10-pin series 057 contact pc board low profile headers; OC_FARNELL: unknown; OC_NEWARK: unknown
X2 X4 = con-subd:F15HPS: SUB-D; OC_FARNELL: unknown; OC_NEWARK: unknown
X3 = con-conrad:73398?: FEMALE PRINT CONNECTOR Niedervolt-Steckverbinder Distributor Conrad